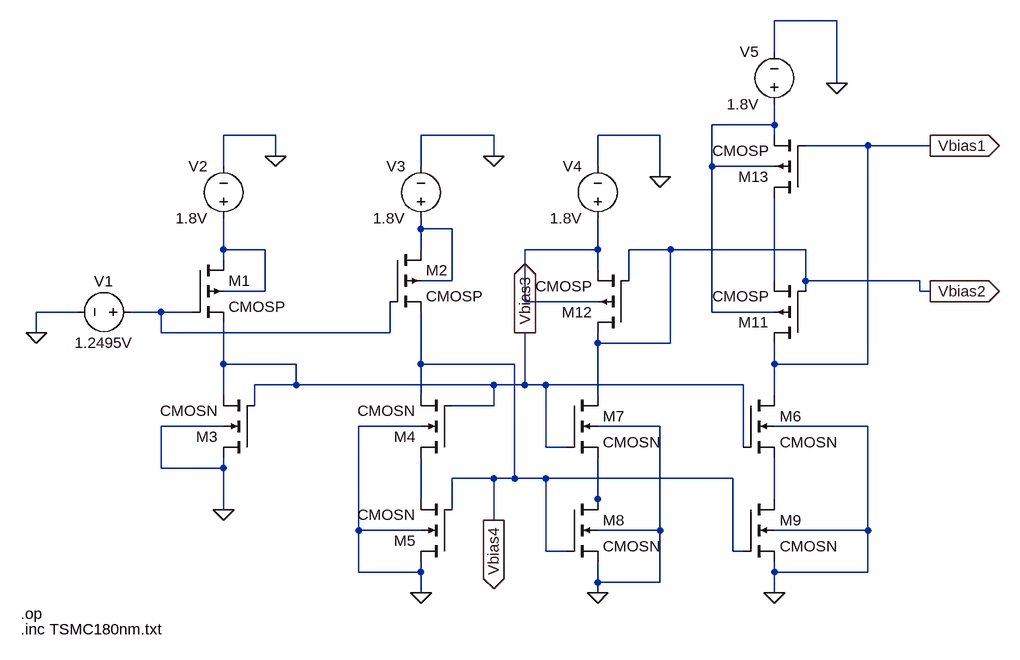
[diagram p0: schematic 2nd.asc]
2nd.asc, the LTspice schematic file:
Version 4
SHEET 1 1096 680
WIRE 816 -336 720 -336
WIRE 720 -288 720 -336
WIRE 816 -240 816 -336
WIRE 720 -176 720 -208
WIRE 720 -176 624 -176
WIRE -48 -160 -128 -160
WIRE 288 -160 176 -160
WIRE 544 -160 448 -160
WIRE 720 -160 720 -176
WIRE 864 -144 768 -144
WIRE 960 -144 864 -144
WIRE -48 -128 -48 -160
WIRE 288 -128 288 -160
WIRE -128 -112 -128 -160
WIRE 176 -112 176 -160
WIRE 448 -112 448 -160
WIRE 624 -112 624 -176
WIRE 720 -112 624 -112
WIRE 544 -96 544 -160
WIRE 176 -16 176 -32
WIRE 224 -16 176 -16
WIRE -128 16 -128 -32
WIRE -64 16 -128 16
WIRE 176 16 176 -16
WIRE 448 16 448 -32
WIRE 448 16 336 16
WIRE 560 16 496 16
WIRE 768 16 560 16
WIRE -128 32 -128 16
WIRE 448 48 448 16
WIRE 224 64 224 -16
WIRE 224 64 176 64
WIRE 496 64 496 16
WIRE 720 64 720 -64
WIRE 768 64 768 16
WIRE 944 64 768 64
WIRE -64 80 -64 16
WIRE -64 80 -128 80
WIRE 768 80 768 64
WIRE 944 80 944 64
WIRE 960 80 944 80
WIRE 336 96 336 16
WIRE 448 96 336 96
WIRE -352 112 -416 112
WIRE -224 112 -272 112
WIRE -176 112 -224 112
WIRE 624 112 624 -112
WIRE 720 112 624 112
WIRE -416 144 -416 112
WIRE -224 144 -224 112
WIRE 128 144 128 96
WIRE 128 144 -224 144
WIRE 448 160 448 144
WIRE 560 160 560 16
WIRE 560 160 448 160
WIRE -128 192 -128 128
WIRE -16 192 -128 192
WIRE 176 192 176 112
WIRE 320 192 176 192
WIRE 720 192 720 160
WIRE 864 192 864 -144
WIRE 864 192 720 192
WIRE -16 224 -16 192
WIRE -16 224 -80 224
WIRE 288 224 -16 224
WIRE 336 224 336 144
WIRE 336 224 288 224
WIRE 368 224 336 224
WIRE 672 224 368 224
WIRE -128 240 -128 192
WIRE 176 240 176 192
WIRE 448 240 448 160
WIRE 720 240 720 192
WIRE -80 256 -80 224
WIRE 288 256 288 224
WIRE 288 256 224 256
WIRE -128 288 -224 288
WIRE 176 288 80 288
WIRE 544 288 448 288
WIRE 864 288 720 288
WIRE 368 320 368 224
WIRE 400 320 368 320
WIRE 672 320 672 224
WIRE -224 352 -224 288
WIRE -128 352 -128 336
WIRE -128 352 -224 352
WIRE 288 368 224 368
WIRE 320 368 320 192
WIRE 320 368 288 368
WIRE 368 368 320 368
WIRE 656 368 368 368
WIRE 176 400 176 336
WIRE 448 400 448 336
WIRE 720 400 720 336
WIRE -128 416 -128 352
WIRE 224 416 224 368
WIRE 448 416 448 400
WIRE 288 432 288 368
WIRE 80 448 80 288
WIRE 176 448 80 448
WIRE 544 448 544 288
WIRE 544 448 448 448
WIRE 864 448 864 288
WIRE 864 448 720 448
WIRE 368 480 368 368
WIRE 400 480 368 480
WIRE 656 480 656 368
WIRE 672 480 656 480
WIRE 80 512 80 448
WIRE 176 512 176 496
WIRE 176 512 80 512
WIRE 720 512 720 496
WIRE 864 512 864 448
WIRE 864 512 720 512
WIRE 448 528 448 496
WIRE 544 528 544 448
WIRE 544 528 448 528
WIRE 176 544 176 512
WIRE 448 544 448 528
WIRE 720 544 720 512
FLAG -128 416 0
FLAG -416 144 0
FLAG -48 -128 0
FLAG 288 -128 0
FLAG 176 544 0
FLAG 448 544 0
FLAG 720 544 0
FLAG 544 -96 0
FLAG 816 -240 0
FLAG 960 -144 Vbias1
IOPIN 960 -144 Out
FLAG 960 80 Vbias2
IOPIN 960 80 Out
FLAG 336 144 Vbias3
IOPIN 336 144 Out
FLAG 288 432 Vbias4
IOPIN 288 432 Out
SYMBOL voltage -256 112 R90
WINDOW 0 -32 56 VBottom 2
WINDOW 3 32 56 VTop 2
WINDOW 123 0 0 Left 0
WINDOW 39 0 0 Left 0
SYMATTR InstName V1
SYMATTR Value 1.2495V
SYMBOL voltage -128 -16 R180
WINDOW 0 24 96 Left 2
WINDOW 3 24 16 Left 2
WINDOW 123 0 0 Left 0
WINDOW 39 0 0 Left 0
SYMATTR InstName V2
SYMATTR Value 1.8V
SYMBOL voltage 176 -16 R180
WINDOW 0 24 96 Left 2
WINDOW 3 24 16 Left 2
WINDOW 123 0 0 Left 0
WINDOW 39 0 0 Left 0
SYMATTR InstName V3
SYMATTR Value 1.8V
SYMBOL nmos4 -80 336 R180
SYMATTR InstName M3
SYMATTR Value2 l=3000n w=530n
SYMATTR Value CMOSN
SYMBOL nmos4 224 336 R180
SYMATTR InstName M4
SYMATTR Value2 l=360n w=1800n
SYMATTR Value CMOSN
SYMBOL nmos4 224 496 R180
SYMATTR InstName M5
SYMATTR Value2 l=360n w=1800n
SYMATTR Value CMOSN
SYMBOL nmos4 400 240 R0
SYMATTR InstName M7
SYMATTR Value2 l=360n w=1800n
SYMATTR Value CMOSN
SYMBOL nmos4 400 400 R0
SYMATTR InstName M8
SYMATTR Value2 l=360n w=1800n
SYMATTR Value CMOSN
SYMBOL nmos4 672 240 R0
SYMATTR InstName M6
SYMATTR Value2 l=360n w=1800n
SYMATTR Value CMOSN
SYMBOL nmos4 672 400 R0
SYMATTR InstName M9
SYMATTR Value2 l=360n w=1800n
SYMATTR Value CMOSN
SYMBOL pmos4 768 160 R180
SYMATTR InstName M11
SYMATTR Value2 l=360n w=4320n
SYMATTR Value CMOSP
SYMBOL pmos4 496 144 R180
SYMATTR InstName M12
SYMATTR Value2 l=900n w=870n
SYMATTR Value CMOSP
SYMBOL pmos4 768 -64 R180
SYMATTR InstName M13
SYMATTR Value2 l=360n w=1000n
SYMATTR Value CMOSP
SYMBOL voltage 448 -16 R180
WINDOW 0 24 96 Left 2
WINDOW 3 24 16 Left 2
WINDOW 123 0 0 Left 0
WINDOW 39 0 0 Left 0
SYMATTR InstName V4
SYMATTR Value 1.8V
SYMBOL voltage 720 -192 R180
WINDOW 0 24 96 Left 2
WINDOW 3 24 16 Left 2
WINDOW 123 0 0 Left 0
WINDOW 39 0 0 Left 0
SYMATTR InstName V5
SYMATTR Value 1.8V
SYMBOL pmos4 -176 32 R0
SYMATTR InstName M1
SYMATTR Value2 l=360n w=4320n
SYMATTR Value CMOSP
SYMBOL pmos4 128 16 R0
SYMATTR InstName M2
SYMATTR Value2 l=360n w=4320n
SYMATTR Value CMOSP
TEXT -440 576 Left 2 !.op
TEXT -440 600 Left 2 !.inc TSMC180nm.txt

The netlist it stands for:
* 2nd.asc
V1 N006 0 1.2495V
V2 N003 0 1.8V
V3 N002 0 1.8V
M3 0 Vbias3 Vbias3 0 CMOSN l=3000n w=530n
M4 N007 Vbias3 Vbias4 0 CMOSN l=360n w=1800n
M5 0 Vbias4 N007 0 CMOSN l=360n w=1800n
M7 Vbias2 Vbias3 N008 0 CMOSN l=360n w=1800n
M8 N008 Vbias4 0 0 CMOSN l=360n w=1800n
M6 Vbias1 Vbias3 N009 0 CMOSN l=360n w=1800n
M9 N009 Vbias4 0 0 CMOSN l=360n w=1800n
M11 Vbias1 Vbias2 N005 N001 CMOSP l=360n w=4320n
M12 Vbias2 Vbias2 N004 N004 CMOSP l=900n w=870n
M13 N005 Vbias1 N001 N001 CMOSP l=360n w=1000n
V4 N004 0 1.8V
V5 N001 0 1.8V
M1 N003 N006 Vbias3 N003 CMOSP l=360n w=4320n
M2 N002 N006 Vbias4 N002 CMOSP l=360n w=4320n
.model NMOS NMOS
.model PMOS PMOS
.lib standard.mos
.op
.inc TSMC180nm.txt
.backanno
.end